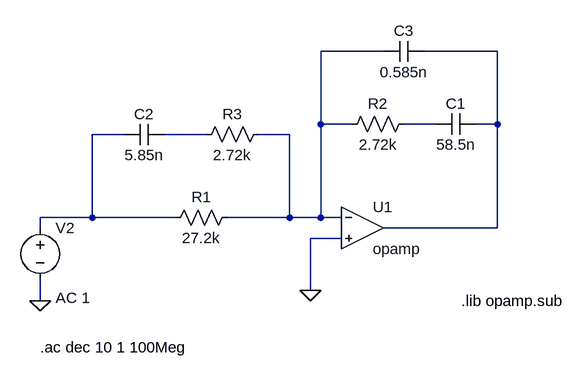
[diagram p0: schematic Draft1.asc]
Draft1.asc, the LTspice schematic file:
Version 4
SHEET 1 880 680
WIRE 528 -208 432 -208
WIRE 704 -208 592 -208
WIRE 432 -96 432 -208
WIRE 480 -96 432 -96
WIRE 608 -96 560 -96
WIRE 704 -96 704 -208
WIRE 704 -96 672 -96
WIRE 128 -80 80 -80
WIRE 256 -80 192 -80
WIRE 384 -80 336 -80
WIRE 80 48 80 -80
WIRE 80 48 0 48
WIRE 208 48 80 48
WIRE 384 48 384 -80
WIRE 384 48 288 48
WIRE 432 48 432 -96
WIRE 432 48 384 48
WIRE 464 48 432 48
WIRE 0 64 0 48
WIRE 704 64 704 -96
WIRE 704 64 528 64
WIRE 464 80 416 80
WIRE 416 160 416 80
WIRE 0 176 0 144
FLAG 0 176 0
FLAG 416 160 0
SYMBOL cap 192 -96 R90
WINDOW 0 0 32 VBottom 2
WINDOW 3 32 32 VTop 2
SYMATTR InstName C2
SYMATTR Value 5.85n
SYMBOL res 304 32 R90
WINDOW 0 0 56 VBottom 2
WINDOW 3 32 56 VTop 2
SYMATTR InstName R1
SYMATTR Value 27.2k
SYMBOL res 352 -96 R90
WINDOW 0 0 56 VBottom 2
WINDOW 3 32 56 VTop 2
SYMATTR InstName R3
SYMATTR Value 2.72k
SYMBOL res 576 -112 R90
WINDOW 0 0 56 VBottom 2
WINDOW 3 32 56 VTop 2
SYMATTR InstName R2
SYMATTR Value 2.72k
SYMBOL cap 672 -112 R90
WINDOW 0 0 32 VBottom 2
WINDOW 3 32 32 VTop 2
SYMATTR InstName C1
SYMATTR Value 58.5n
SYMBOL cap 592 -224 R90
WINDOW 0 0 32 VBottom 2
WINDOW 3 32 32 VTop 2
SYMATTR InstName C3
SYMATTR Value 0.585n
SYMBOL voltage 0 48 R0
WINDOW 123 24 124 Left 2
WINDOW 39 0 0 Left 0
SYMATTR Value2 AC 1
SYMATTR InstName V2
SYMATTR Value ""
SYMBOL OpAmps\\opamp 496 0 R0
SYMATTR InstName U1
SYMATTR SpiceLine2 GBW=1000Meg
TEXT 0 248 Left 2 !.ac dec 10 1 100Meg
TEXT 648 176 Left 2 !.lib opamp.sub

The netlist it stands for:
* Draft1.asc
C2 N005 N004 5.85n
R1 N001 N004 27.2k
R3 N001 N005 2.72k
R2 N003 N001 2.72k
C1 N002 N003 58.5n
C3 N002 N001 0.585n
V2 N004 0 AC 1
XU1 N001 0 N002 opamp Aol=100K GBW=1000Meg  ; pins invin noninvin out
.ac dec 10 1 100Meg
.lib opamp.sub
.backanno
.end